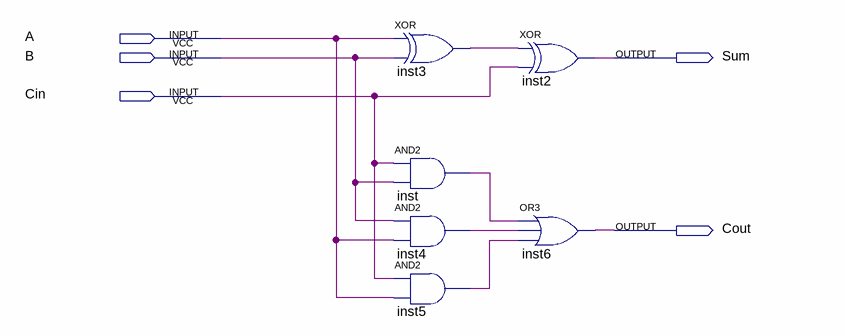
[diagram p0: schematic sheet]
// Quartus schematic FullAdder.bdf as structural Verilog: 6 symbols, 5 pins
module FullAdder (
  input  A,
  input  B,
  input  Cin,
  output Sum,
  output Cout
);

  wire inst3_out, inst4_out, inst5_out, inst_out;

  xor inst3 (inst3_out, A, B);
  and inst (inst_out, Cin, B);
  and inst4 (inst4_out, B, A);
  and inst5 (inst5_out, Cin, A);
  xor inst2 (Sum, inst3_out, Cin);
  or inst6 (Cout, inst_out, inst4_out, inst5_out);
endmodule
